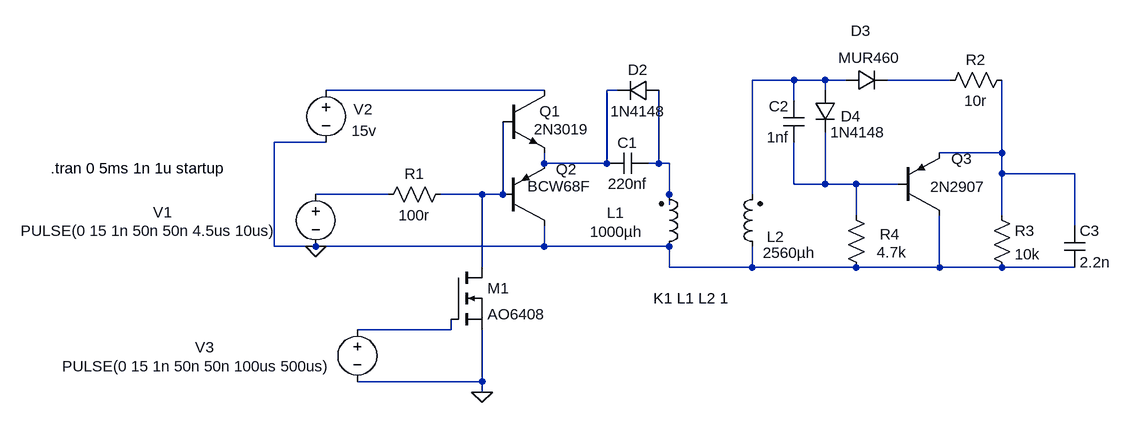
[diagram p0: schematic 驱动变压器正压驱动仿真.asc]
驱动变压器正压驱动仿真.asc, the LTspice schematic file:
Version 4
SHEET 1 1268 680
WIRE 704 -48 640 -48
WIRE 752 -48 704 -48
WIRE 784 -48 752 -48
WIRE 944 -48 848 -48
WIRE 320 -32 -16 -32
WIRE 432 -32 416 -32
WIRE 752 -32 752 -48
WIRE 704 -16 704 -48
WIRE -16 48 -96 48
WIRE 1024 64 1024 -48
WIRE 1024 64 928 64
WIRE 320 80 320 64
WIRE 416 80 416 -32
WIRE 416 80 320 80
WIRE 496 80 496 -32
WIRE 496 80 480 80
WIRE 512 80 496 80
WIRE 1024 96 1024 64
WIRE 1136 96 1024 96
WIRE 704 112 704 48
WIRE 752 112 752 32
WIRE 752 112 704 112
WIRE 800 112 752 112
WIRE 864 112 800 112
WIRE 80 128 -32 128
WIRE 224 128 160 128
WIRE 256 128 256 16
WIRE 256 128 224 128
WIRE 512 128 512 80
WIRE 640 128 640 -48
WIRE 512 144 512 128
WIRE 800 160 800 112
WIRE 1024 160 1024 96
WIRE 1136 176 1136 96
WIRE -96 208 -96 48
WIRE -32 208 -96 208
WIRE 320 208 320 176
WIRE 320 208 -32 208
WIRE 512 208 320 208
WIRE 224 240 224 128
WIRE 512 240 512 208
WIRE 640 240 640 208
WIRE 640 240 512 240
WIRE 800 240 640 240
WIRE 928 240 928 160
WIRE 928 240 800 240
WIRE 1024 240 928 240
WIRE 1136 240 1024 240
WIRE 176 336 176 320
WIRE 176 336 32 336
WIRE 224 416 224 336
WIRE 224 416 32 416
WIRE 224 432 224 416
FLAG -32 208 0
FLAG 224 432 0
SYMBOL voltage -32 112 R0
WINDOW 0 -250 43 Left 2
WINDOW 3 -454 72 Left 2
WINDOW 123 0 0 Left 2
WINDOW 39 0 0 Left 2
SYMATTR InstName V1
SYMATTR Value PULSE(0 15 1n 50n 50n 4.5us 10us)
SYMBOL voltage -16 -48 R0
WINDOW 0 42 45 Left 2
WINDOW 3 39 78 Left 2
WINDOW 123 0 0 Left 2
WINDOW 39 0 0 Left 2
SYMATTR InstName V2
SYMATTR Value 15v
SYMBOL npn 256 -32 R0
WINDOW 3 48 60 Left 2
SYMATTR Value 2N3019
SYMATTR InstName Q1
SYMBOL pnp 256 176 M180
WINDOW 0 82 87 Left 2
WINDOW 3 38 61 Left 2
SYMATTR InstName Q2
SYMATTR Value BCW68F
SYMBOL res 176 112 R90
WINDOW 0 0 56 VBottom 2
WINDOW 3 32 56 VTop 2
SYMATTR InstName R1
SYMATTR Value 100r
SYMBOL cap 480 64 R90
WINDOW 0 0 32 VBottom 2
WINDOW 3 32 32 VTop 2
SYMATTR InstName C1
SYMATTR Value 220nf
SYMBOL ind2 496 224 M180
WINDOW 0 -80 68 Left 2
WINDOW 3 -106 39 Left 2
SYMATTR InstName L1
SYMATTR Value 1000µh
SYMATTR Type ind
SYMBOL ind2 656 224 R180
WINDOW 0 -33 31 Left 2
WINDOW 3 -81 6 Left 2
SYMATTR InstName L2
SYMATTR Value 2560µh
SYMATTR Type ind
SYMBOL res 1040 -64 R90
WINDOW 0 0 56 VBottom 2
WINDOW 3 32 56 VTop 2
SYMATTR InstName R2
SYMATTR Value 10r
SYMBOL res 1008 144 R0
SYMATTR InstName R3
SYMATTR Value 10k
SYMBOL nmos 176 240 R0
SYMATTR InstName M1
SYMATTR Value AO6408
SYMBOL voltage 32 320 R0
WINDOW 0 -250 43 Left 2
WINDOW 3 -454 72 Left 2
WINDOW 123 0 0 Left 2
WINDOW 39 0 0 Left 2
SYMATTR InstName V3
SYMATTR Value PULSE(0 15 1n 50n 50n 100us 500us)
SYMBOL diode 496 -48 R90
WINDOW 0 0 32 VBottom 2
WINDOW 3 32 32 VTop 2
SYMATTR InstName D2
SYMATTR Value 1N4148
SYMBOL diode 784 -32 R270
WINDOW 0 76 23 VTop 2
WINDOW 3 66 36 VBottom 2
SYMATTR InstName D3
SYMATTR Value MUR460
SYMBOL pnp 864 160 M180
WINDOW 0 82 87 Left 2
WINDOW 3 50 44 Left 2
SYMATTR InstName Q3
SYMATTR Value 2N2907
SYMBOL diode 736 -32 R0
WINDOW 0 40 40 Left 2
SYMATTR InstName D4
SYMATTR Value 1N4148
SYMBOL res 816 256 R180
WINDOW 0 -51 67 Left 2
WINDOW 3 -61 39 Left 2
SYMATTR InstName R4
SYMATTR Value 4.7k
SYMBOL cap 720 48 R180
WINDOW 0 24 56 Left 2
WINDOW 3 24 8 Left 2
SYMATTR InstName C2
SYMATTR Value 1nf
SYMBOL cap 1120 176 R0
SYMATTR InstName C3
SYMATTR Value 2.2n
TEXT 488 288 Left 2 !K1 L1 L2 1
TEXT -440 88 Left 2 !.tran 0 5ms 1n 1u startup

The netlist it stands for:
* 驱动变压器正压驱动仿真.asc
V1 N008 0 PULSE(0 15 1n 50n 50n 4.5us 10us)
V2 N003 0 15v
Q1 N003 N009 N004 0 2N3019
Q2 0 N009 N004 0 BCW68F
R1 N009 N008 100r
C1 N006 N004 220nf
L1 0 N006 1000µh
L2 0 N001 2560µh
R2 N005 N002 10r
R3 N005 0 10k
M1 N009 N010 0 0 AO6408
V3 N010 0 PULSE(0 15 1n 50n 50n 100us 500us)
D2 N006 N004 1N4148
D3 N001 N002 MUR460
Q3 0 N007 N005 0 2N2907
D4 N001 N007 1N4148
R4 0 N007 4.7k
C2 N007 N001 1nf
C3 N005 0 2.2n
.model D D
.lib standard.dio
.model NPN NPN
.model PNP PNP
.lib standard.bjt
.model NMOS NMOS
.model PMOS PMOS
.lib standard.mos
K1 L1 L2 1
.tran 0 5ms 1n 1u startup
.backanno
.end